# EAGLE schematic Brakeout board - VEML7700 (EAGLE 9.6.2)
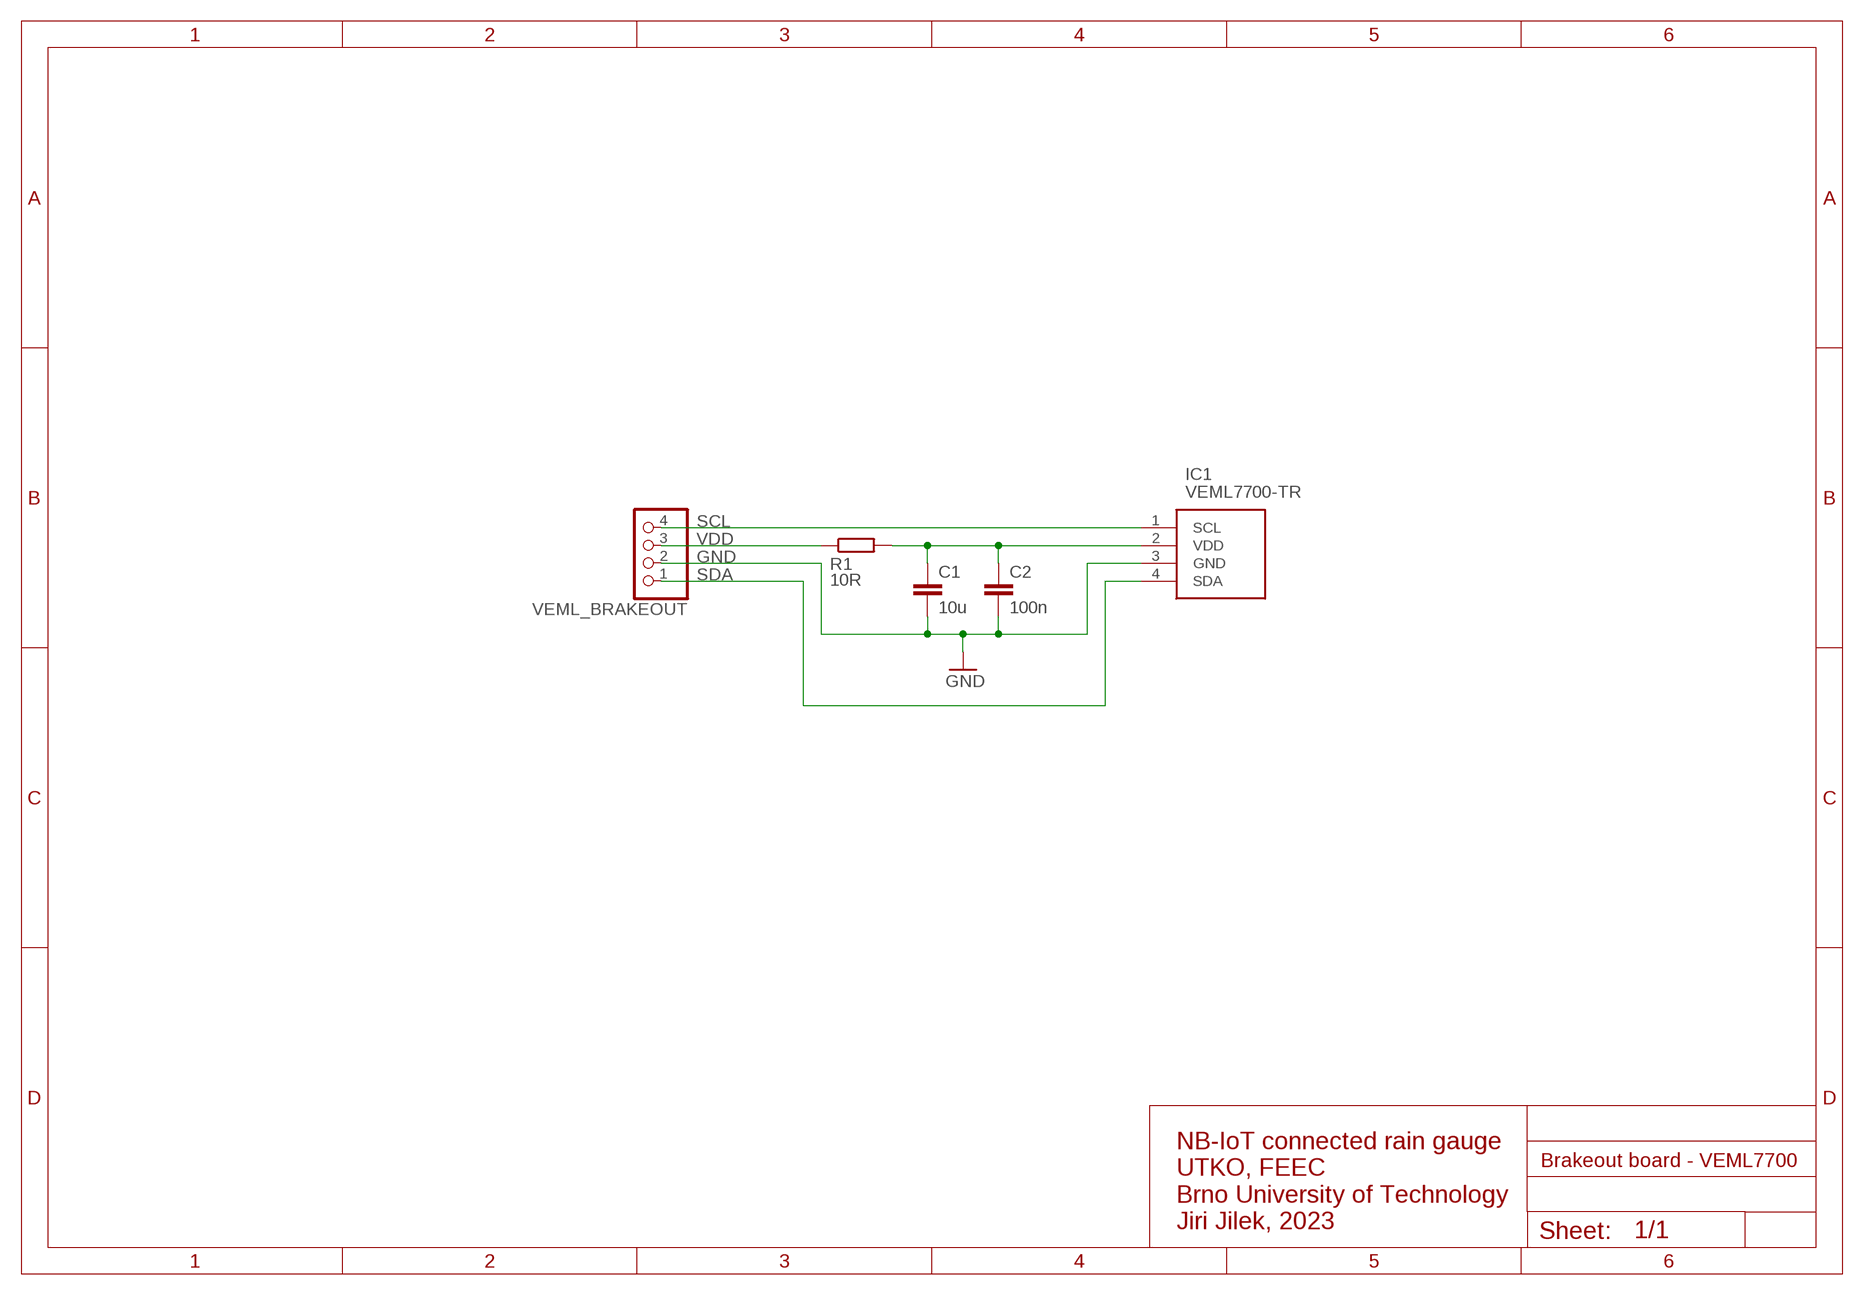
[diagram p0: schematic, sheet 1]

## Parts
C1  10u  C-EUC0805  [C0805]
C2  100n  C-EUC0805  [C0805]
IC1  VEML7700-TR  [VEML7700]
R1  10R  R-EU_R0805  [R0805]
VEML_BRAKEOUT  PINHD-1X4  [1X04]

## Nets
GND: C1.2 C2.2 IC1.3(GND) VEML_BRAKEOUT.2
N$2: C1.1 C2.1 IC1.2(VDD) R1.2
SCL: IC1.1(SCL) VEML_BRAKEOUT.4
SDA: IC1.4(SDA) VEML_BRAKEOUT.1
VDD: R1.1 VEML_BRAKEOUT.3

## Notes on the sheet
- NB-IoT connected rain gauge
  UTKO, FEEC
  Brno University of Technology
  Jiri Jilek, 2023

## Library data of the parts
C1 C2 = rcl:C-EU: CAPACITOR, European symbol; SPICEPREFIX: C
IC1 = 1-component-search:VEML7700-TR: High Accuracy Ambient Light Sensor with I2C Interface Source: Datasheet <http://www.vishay.com/docs/84286/veml7700.pdf>; ARROW_PART_NUMBER: VEML7700-TR; ARROW_PRICE-STOCK: https://www.arrow.com/en/products/veml7700-tr/vishay?region=nac; DESCRIPTION: High Accuracy Ambient Light Sensor with I2C Interface; HEIGHT: mm; MANUFACTURER_NAME: Vishay; MANUFACTURER_PART_NUMBER: VEML7700-TR; MOUSER_PART_NUMBER: 78-VEML7700-TR; MOUSER_PRICE-STOCK: https://www.mouser.co.uk/ProductDetail/Vishay-Semiconductors/VEML7700-TR?qs=BcfjnG7NVaWcZHs8m27pyQ%3D%3D
R1 = rcl:R-EU_: RESISTOR, European symbol; SPICEPREFIX: R
VEML_BRAKEOUT = pinhead:PINHD-1X4: PIN HEADER